# EAGLE design FWBC_v2 (EAGLE 9.1.3)
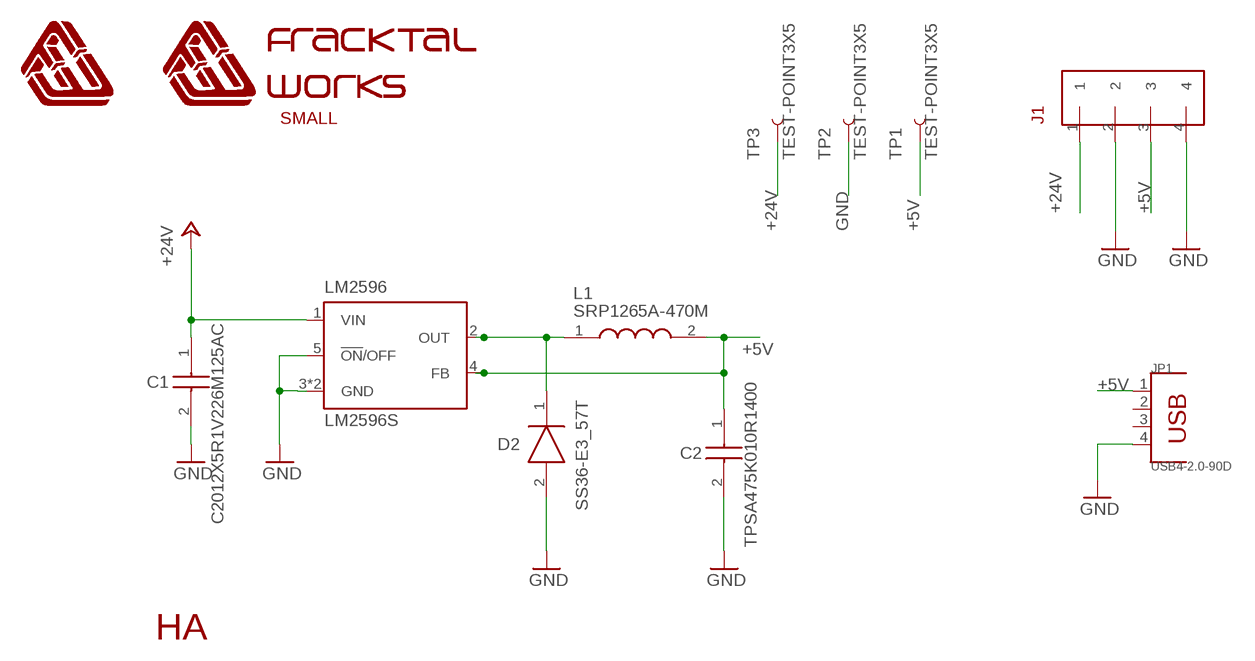
[diagram p0: schematic, sheet 1]

## Parts
C1  C2012X5R1V226M125AC  [CAPC2012X145N]
C2  TPSA475K010R1400  [CAPPM3216X180N]
D2  SS36-E3_57T  [DIOM7959X262N]
J1  TERMINALBLOCK/TOYO/4PIN/5MMPITCH  [TERMINALBLOCK/TOYO/4PIN/5MMPITCH]
JP1  USB4-2.0-90D  DIP-USB-A-TYPE-FMAL(4+2P-2.0-90D)  [USB4+2P-2.0-90D]
L1  SRP1265A-470M  [SRP1265A]
LM2596  LM2596S  [LM2596_TO263-5]
M_HA_1  HA_MARK  [HA_MARK]
TP1  TEST-POINT3X5  [PAD.03X.05]
TP2  TEST-POINT3X5  [PAD.03X.05]
TP3  TEST-POINT3X5  [PAD.03X.05]
U$1  FWLOGO  [FWLOGO]
U$2  FWLOGO_TEXT_SMALL  [FWLOGO_TEXT_SMALL]

## Nets
+5V: C2.1 J1.3 JP1.1 L1.2 LM2596.4(FB) TP1.P$1
+24V: C1.1 J1.1 LM2596.1(VIN) TP3.P$1
GND: C1.2 C2.2 D2.2(A) J1.2 J1.4 JP1.4 LM2596.3(GND) LM2596.5(!ON!/OFF) LM2596.6(GND) TP2.P$1
N$2: D2.1(K) L1.1 LM2596.2(OUT)
Unconnected: JP1.2 JP1.3 JP1.SG1(GND) JP1.SG2(GND)

## Library data of the parts
C1 = SamacSys_Parts:C2012X5R1V226M125AC: TDK 0805 C 22uF Ceramic Multilayer Capacitor, 35 V dc, +85C, X5R Dielectric, +/-20% Source: Datasheet <https://product.tdk.com/info/en/catalog/datasheets/mlcc_commercial_midvoltage_en.pdf>; DESCRIPTION: TDK 0805 C 22uF Ceramic Multilayer Capacitor, 35 V dc, +85C, X5R Dielectric, +/-20%; HEIGHT: 1.45mm; MANUFACTURER_NAME: TDK; MANUFACTURER_PART_NUMBER: C2012X5R1V226M125AC; MOUSER_PART_NUMBER: 810-C2012X5R1V226MAC; MOUSER_PRICE-STOCK: https://www.mouser.com/Search/Refine.aspx?Keyword=810-C2012X5R1V226MAC; RS_PART_NUMBER: 9159334P; RS_PRICE-STOCK: http://uk.rs-online.com/web/p/products/9159334P
C2 = SamacSys_Parts:TPSA475K010R1400: AVX 4.7 Source: Datasheet <http://datasheets.avx.com/TPS.pdf>; ALLIED_NUMBER: 70002395; ALLIED_PRICE-STOCK: http://www.alliedelec.com/avx-tpsa475k010r1400/70002395/; DESCRIPTION: AVX 4.7; HEIGHT: 1.8mm; MANUFACTURER_NAME: AVX; MANUFACTURER_PART_NUMBER: TPSA475K010R1400; MOUSER_PART_NUMBER: 581-TPSA475K010R1400; MOUSER_PRICE-STOCK: https://www.mouser.com/Search/Refine.aspx?Keyword=581-TPSA475K010R1400; RS_PART_NUMBER: 1366129; RS_PRICE-STOCK: http://uk.rs-online.com/web/p/products/1366129
D2 = SamacSys_Parts:SS36-E3_57T: SS36-E3/57T, Schottky Diode, 3A max, 60V, 2-Pin, SMC Source: Datasheet <https://componentsearchengine.com/Datasheets/2/SS36-E3_57T.pdf>; ALLIED_NUMBER: 70217328; ALLIED_PRICE-STOCK: https://www.alliedelec.com/general-semiconductor-vishay-ss36-e3-57t/70217328/; DESCRIPTION: SS36-E3/57T, Schottky Diode, 3A max, 60V, 2-Pin, SMC; HEIGHT: 2.62mm; MANUFACTURER_NAME: Vishay; MANUFACTURER_PART_NUMBER: SS36-E3/57T; MOUSER_PART_NUMBER: 625-SS36-E3; MOUSER_PRICE-STOCK: https://www.mouser.com/Search/Refine.aspx?Keyword=625-SS36-E3; RS_PART_NUMBER: 7000975P; RS_PRICE-STOCK: http://uk.rs-online.com/web/p/products/7000975P
J1 = FracktalWorks:TERMINALBLOCK/TOYO/4PIN/5MMPITCH
JP1 = Seeed-Connector:DIP-USB-A-TYPE-FMAL(4+2P-2.0-90D): 320010007
L1 = SamacSys_Parts:SRP1265A-470M: Bourns SRP1265A Series Shielded Wire-wound SMD Inductor with a Carbonyl Powder Core, 47 uH 20% 6.5A Idc Source: Datasheet <https://www.bourns.com/docs/Product-Datasheets/SRP1265A.pdf>; DESCRIPTION: Bourns SRP1265A Series Shielded Wire-wound SMD Inductor with a Carbonyl Powder Core, 47 uH 20% 6.5A Idc; HEIGHT: mm; MANUFACTURER_NAME: Bourns; MANUFACTURER_PART_NUMBER: SRP1265A-470M; MOUSER_PART_NUMBER: 652-SRP1265A-470M; MOUSER_PRICE-STOCK: https://www.mouser.com/Search/Refine.aspx?Keyword=652-SRP1265A-470M; RS_PART_NUMBER: 8193513P; RS_PRICE-STOCK: http://uk.rs-online.com/web/p/products/8193513P
LM2596 = FracktalWorks:LM2596: SIMPLE SWITCHER® Power Converter 150 kHz 3A Step-Down Voltage Regulator Source: http://www.national.com/ds/LM/LM2596.pdf; MF: NATIONAL SEMICONDUCTOR; MPN: LM2596S-ADJ/NOPB; OC_FARNELL: 9494367; OC_NEWARK: 41K3842
M_HA_1 = FracktalWorks:HA_MARK: Maker mark
TP1-TP3 = SparkFun-Connectors:TEST-POINT: SparkFun Test Points Bare copper test points for troubleshooting or In-Circuit-Testing. These are used by our Production team for verifying production board runs using pogo-pins on test beds. SparkFun Products: SparkFun LSM9DS1 Breakout <https://www.sparkfun.com/products/13284> SparkFun PSOC <https://www.sparkfun.com/products/13714> SparkFun Load Cell Amplifier <https://www.sparkfun.com/products/13879>
U$1 = FracktalWorks:FWLOGO: Fracktal Works Logo without name
U$2 = FracktalWorks:FWLOGO_TEXT_SMALL

## Board
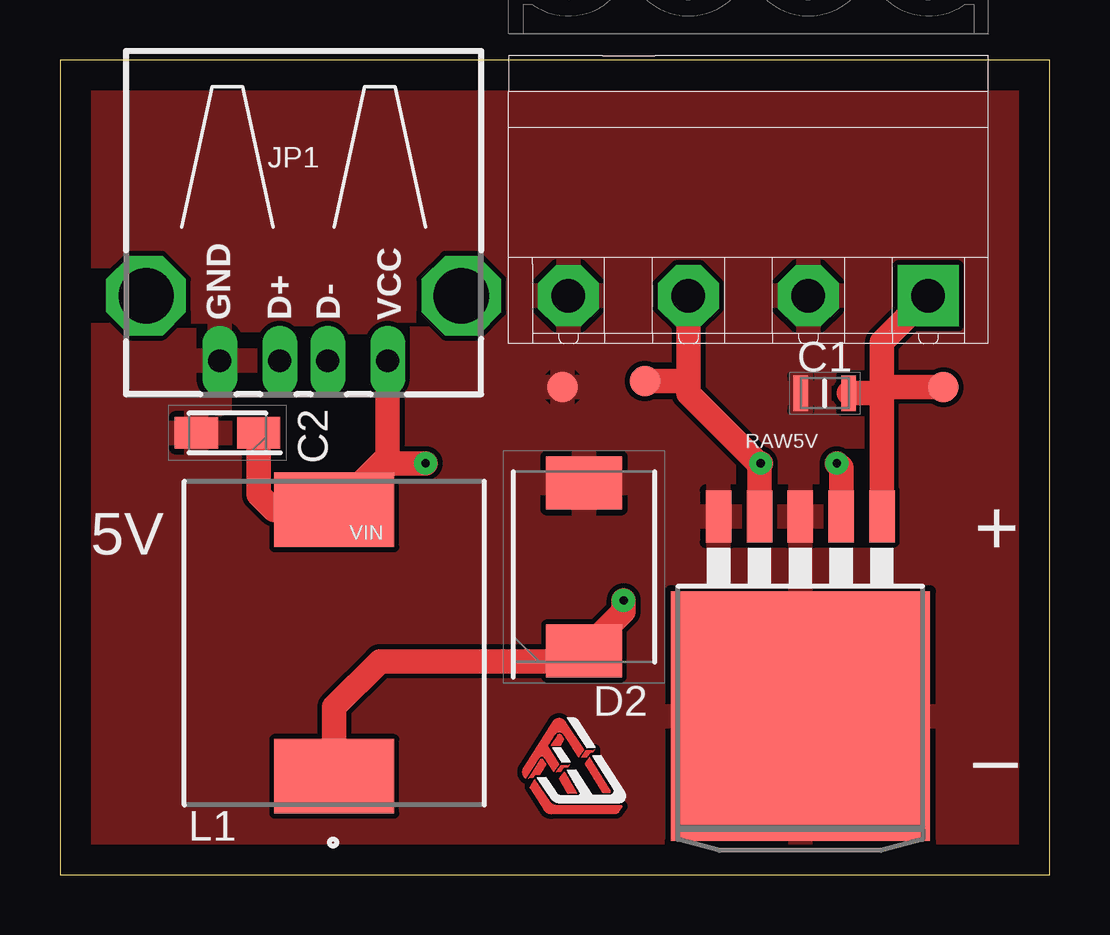
[diagram p1: board, top side]
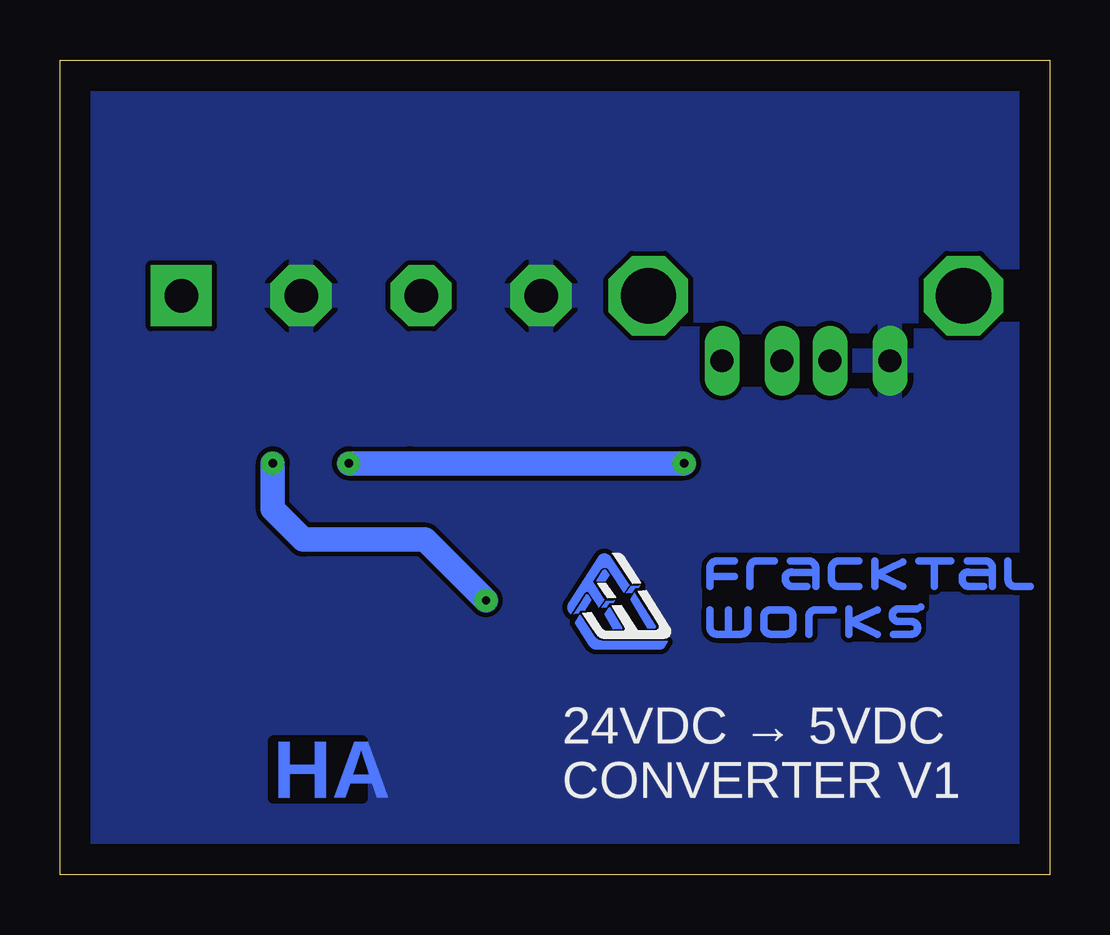
[diagram p2: board, bottom side, seen from below]

Size 41.26 x 33.96 mm. Coordinates in mm from the lower left corner, seen from the top.
Outline: 0,0 41.26,0 41.26,33.96 0,33.96 0,0
Copper layers (1*16): Top 0.035mm / dielectric 1.5mm / Bottom 0.035mm
Design rules "LionCircuits": minimum track width 8mil, minimum drill 0.35mm, track to track 8mil, track to pad 8mil, pad to pad 8mil, via to via 8mil, smd to smd 8mil, copper to edge 50mil, drill to drill 10mil, minimum pad ring 10mil, minimum via ring 8mil, stop-mask expansion 4mil, vias tented up to drill 0mil, thermal gap 10mil

### Footprints (pad centres in the part's own frame; a part is rotated, then mirrored left to right if it is on the bottom)
CAPC2012X145N = smd 0.62 x 1.47: 1 -1,0; 2 1,0
CAPPM3216X180N = smd 1.8 x 1.3: 1 -1.3,0; 2 1.3,0
DIOM7959X262N = smd 2.2 x 3.15: 1 -3.5,0; 2 3.5,0
TERMINALBLOCK/TOYO/4PIN/5MMPITCH = drill 1.4 pad 2.54 square: 1 0,0 | drill 1.4 pad 2.54 octagon: 2 5,0; 3 10,0; 4 15,0
USB4+2P-2.0-90D = drill 0.95 long: 1 -3.5,2.71; 2 -1,2.71; 3 1,2.71; 4 3.5,2.71 | drill 2.3 octagon: SG1 -6.57,0; SG2 6.57,0
SRP1265A = smd 3.1 x 5: 1 -5.55,0; 2 5.55,0
LM2596_TO263-5 = smd 1.067 x 2.159: 1 -3.404,-5.791; 2 -1.702,-5.791; 3 0,-5.791; 4 1.702,-5.791; 5 3.404,-5.791 | smd 10.8 x 10.41: 6 0,2.54
PAD.03X.05 = smd 1.27 x 1.27: P$1 0,0

### Placement (x,y rotation side)
C1  31.88,20.07 180 top
C2  6.98,18.41 180 top
D2  21.84,12.83 90 top
J1  36.2,24.13 180 top
JP1  10.16,24.13 180 top
L1  11.43,9.65 90 top
LM2596  30.86,9.14 180 top
M_HA_1  32.38,3.17 0 bottom
TP1  24.38,20.57 0 top
TP2  20.95,20.32 0 top
TP3  36.83,20.32 0 top
U$1  17.78,1.4 0 top
U$2  20.32,8.26 0 bottom

### Tracks (layer width: path | path; a pad name or v marks a point on that pad's centre or on a via)
+5V  (via drill 0.35 pad 0.95)
  Top 1.016: LM2596.4 29.16,17.09 | 29.16,17.09 v29.21,17.14 | L1.2 13.37,17.14 | 13.37,17.14 v15.24,17.14 | L1.2 | J1.3 26.2,20.32 | 26.2,20.32 26.2,20.06 29.16,17.09 | TP1.P$1 25.94,20.57 26.2,20.32 | C2.1 8.29,15.85 8.93,15.2 L1.2 | JP1.1 13.66,17.43 13.37,17.14
  Bottom 1.016: v29.21,17.14 26.67,17.14 v15.24,17.14
+24V
  Top 1.016: LM2596.1 34.27,20.32 | 34.27,20.32 34.27,22.2 J1.1 | C1.1 34.01,20.07 34.27,20.32 | TP3.P$1 34.27,20.32
GND
  pour Bottom: -2.54,35.56 -2.54,-1.27 42.55,-1.27 42.55,35.56
  pour Top: -1.27,36.83 -1.27,-2.54 43.81,-2.54 43.81,36.83
N$2  (via drill 0.35 pad 0.95)
  Top 1.016: LM2596.2 32.56,16.97 v32.38,17.14 | v23.49,11.43 23.49,10.98 D2.1 21.41,8.89 13.34,8.89 11.43,6.99 L1.1
  Bottom 1.016: v32.38,17.14 32.38,15.24 31.12,13.97 26.04,13.97 v23.49,11.43

### Text on the board
tPlace: RAW5V | VIN | 5V | + | _
bPlace: 24VDC → 5VDC / CONVERTER V1